# EAGLE schematic MVSch5 (EAGLE 9.6.2)
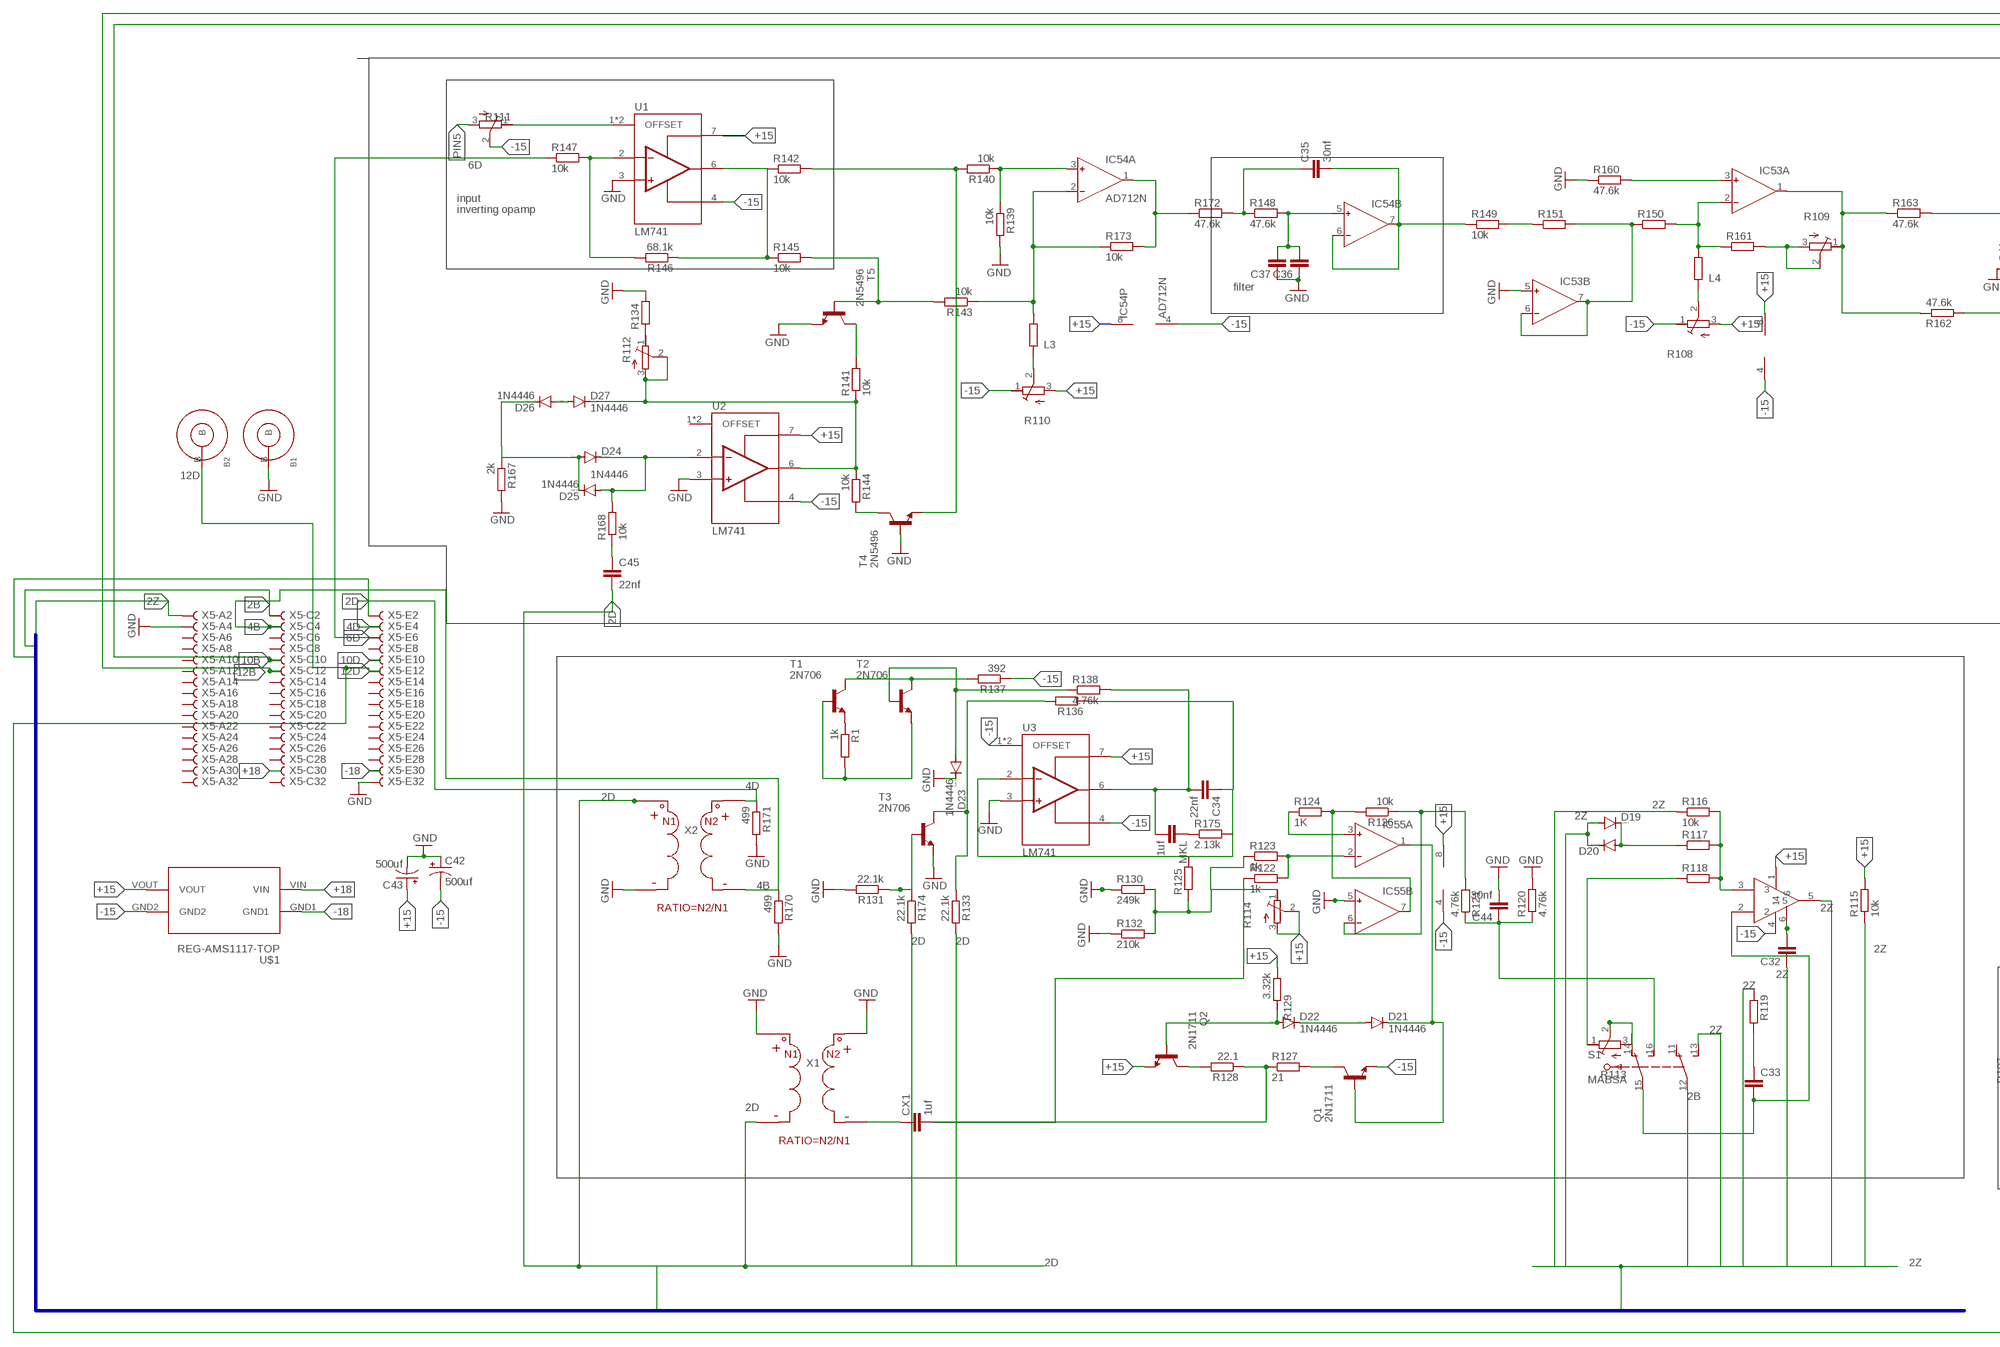
[diagram p0: schematic, sheet 1, part 1 of 2]
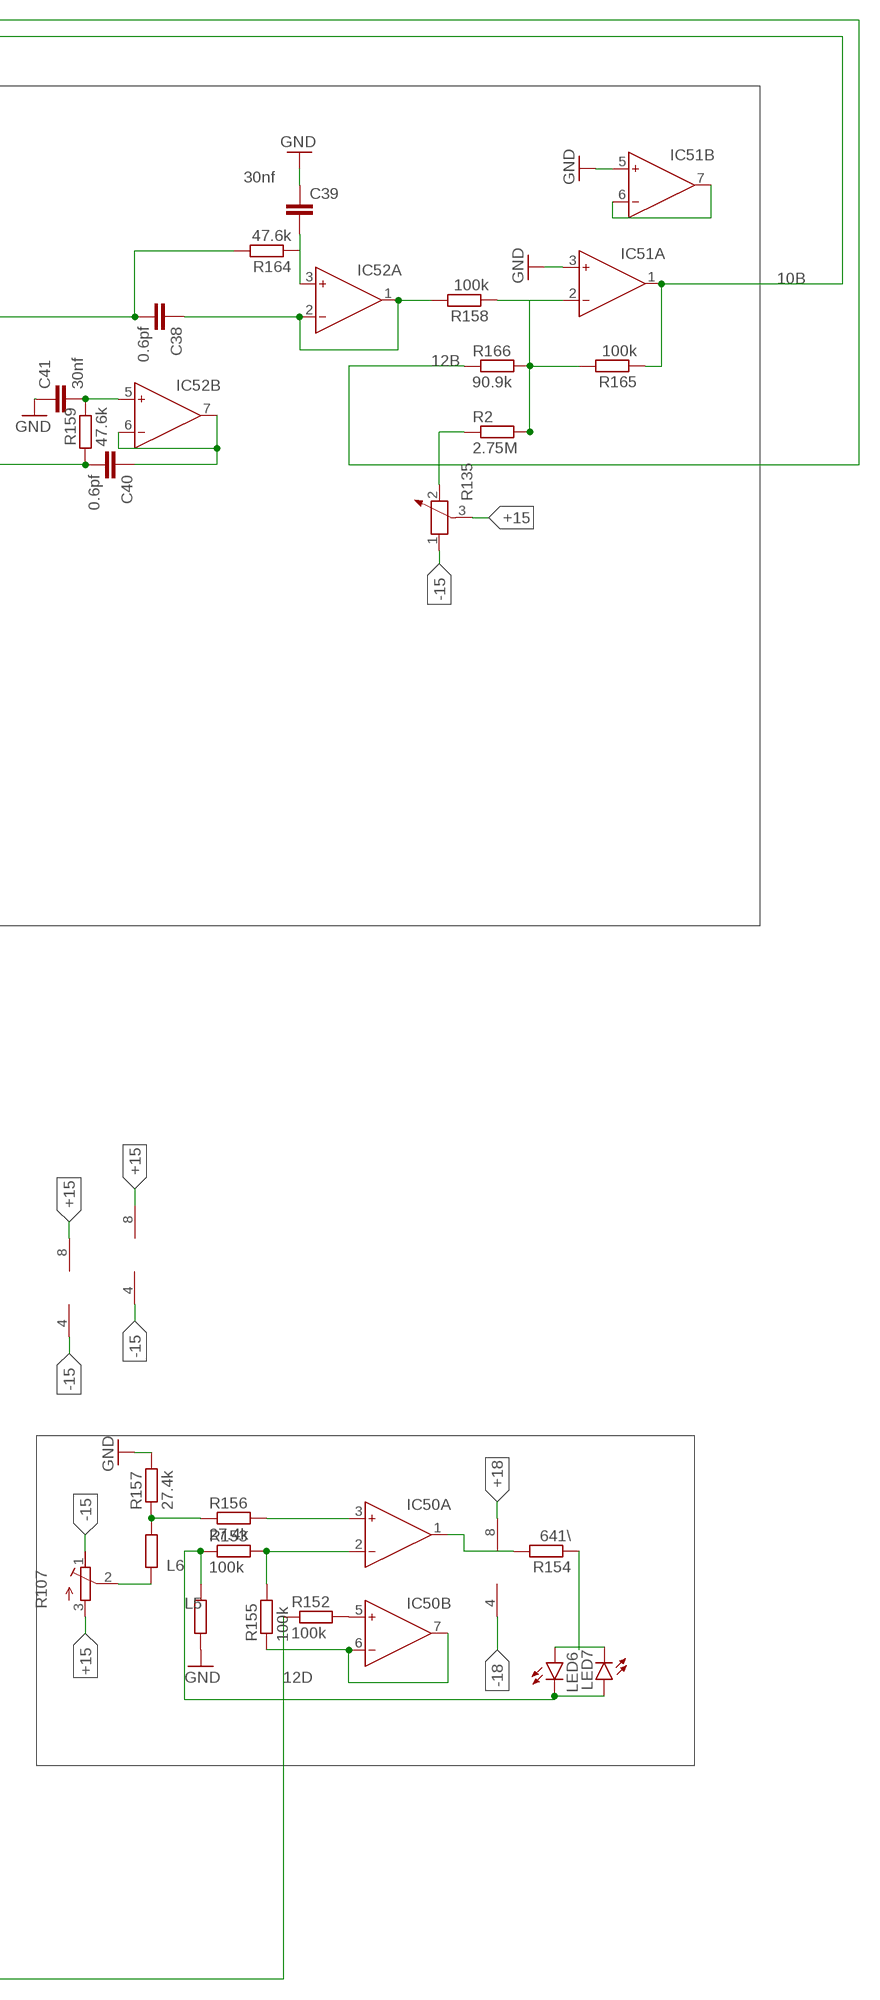
[diagram p1: schematic, sheet 1, part 2 of 2]

## Parts
B1  BANANA_CONNECTOR_DEVICE  [BANANA_CONNECTOR_FOOTPRINT]
B2  BANANA_CONNECTOR_DEVICE  [BANANA_CONNECTOR_FOOTPRINT]
C32  C-EU025-025X050  [C025-025X050]
C33  C-EU075-032X103  [C075-032X103]
C34  22nf  C-EU050-024X044  [C050-024X044]
C35  30nf  C-EU050-024X044  [C050-024X044]
C36  C-EU050-024X044  [C050-024X044]
C37  C-EU050-024X044  [C050-024X044]
C38  0.6pf  C-EU050-024X044  [C050-024X044]
C39  30nf  C-EU050-024X044  [C050-024X044]
C40  0.6pf  C-EU050-024X044  [C050-024X044]
C41  30nf  C-EU050-024X044  [C050-024X044]
C42  500uf  CPOL-USE35-12AXIAL  [E35-12]
C43  500uf  CPOL-USE35-12AXIAL  [E35-12]
C44  30nf  C-EU075-032X103  [C075-032X103]
C45  22nf  C-EU050-024X044  [C050-024X044]
CX1  1uf  CXXC15B8  [XC15B8]
D19  1N4446  [DO35-10]
D20  1N4446  [DO35-10]
D21  1N4446  [DO35-10]
D22  1N4446  [DO35-10]
D23  1N4446  [DO35-10]
D24  1N4446  [DO35-10]
D25  1N4446  [DO35-10]
D26  1N4446  [DO35-10]
D27  1N4446  [DO35-10]
IC50  AD712N  [DIL08]
IC51  AD712N  [DIL08]
IC52  AD712N  [DIL08]
IC53  AD712N  [DIL08]
IC54  AD712N  [DIL08]
IC55  AD712N  [DIL08]
L3  R-EU_0204/7  [0204/7]
L4  R-EU_0204/7  [0204/7]
L5  R-EU_0204/7  [0204/7]
L6  R-EU_0204/7  [0204/7]
LED6  LED5MM  [LED5MM]
LED7  LED5MM  [LED5MM]
MKL  1uf  C-EU075-052X106  [C075-052X106]
OP1  TAA761_DEVICE  [SOIC8_208MIL]
Q1  2N1711  [TO39]
Q2  2N1711  [TO39]
R1  1k  R-EU_0204/7  [0204/7]
R2  2.75M  R-EU_0204/7  [0204/7]
R107  R-TRIMM43P  [RTRIM43P]
R108  R-TRIMM43P  [RTRIM43P]
R109  R-TRIMM43P  [RTRIM43P]
R110  R-TRIMM43P  [RTRIM43P]
R111  R-TRIMM43P  [RTRIM43P]
R112  R-TRIMM43P  [RTRIM43P]
R113  R-TRIMM43P  [RTRIM43P]
R114  R-TRIMM43P  [RTRIM43P]
R115  10k  R-EU_0204/7  [0204/7]
R116  10k  R-EU_0204/7  [0204/7]
R117  R-EU_0204/7  [0204/7]
R118  R-EU_0204/7  [0204/7]
R119  R-EU_0204/7  [0204/7]
R120  4.76k  R-EU_0204/7  [0204/7]
R121  4.76k  R-EU_0204/7  [0204/7]
R122  1k  R-EU_0204/7  [0204/7]
R123  1k  R-EU_0204/7  [0204/7]
R124  1K  R-EU_0204/7  [0204/7]
R125  R-EU_0204/7  [0204/7]
R126  10k  R-EU_0204/7  [0204/7]
R127  21  R-EU_0204/7  [0204/7]
R128  22.1  R-EU_0204/7  [0204/7]
R129  3.32k  R-EU_0204/7  [0204/7]
R130  249k  R-EU_0204/7  [0204/7]
R131  22.1k  R-EU_0204/7  [0204/7]
R132  210k  R-EU_0204/7  [0204/7]
R133  22.1k  R-EU_0204/7  [0204/7]
R134  R-EU_0204/7  [0204/7]
R135  POTENTIOMETER_PT-10  [PT-10]
R136  R-EU_0204/7  [0204/7]
R137  392  R-EU_0204/7  [0204/7]
R138  4.76k  R-EU_0204/7  [0204/7]
R139  10k  R-EU_0204/7  [0204/7]
R140  10k  R-EU_0204/7  [0204/7]
R141  10k  R-EU_0204/7  [0204/7]
R142  10k  R-EU_0204/7  [0204/7]
R143  10k  R-EU_0204/7  [0204/7]
R144  10k  R-EU_0204/7  [0204/7]
R145  10k  R-EU_0204/7  [0204/7]
R146  68.1k  R-EU_0204/7  [0204/7]
R147  10k  R-EU_0204/7  [0204/7]
R148  47.6k  R-EU_0204/7  [0204/7]
R149  10k  R-EU_0204/7  [0204/7]
R150  R-EU_0204/7  [0204/7]
R151  R-EU_0204/7  [0204/7]
R152  100k  R-EU_0204/7  [0204/7]
R153  100k  R-EU_0204/7  [0204/7]
R154  641\  R-EU_0204/7  [0204/7]
R155  100k  R-EU_0204/7  [0204/7]
R156  27.4k  R-EU_0204/7  [0204/7]
R157  27.4k  R-EU_0204/7  [0204/7]
R158  100k  R-EU_0204/7  [0204/7]
R159  47.6k  R-EU_0204/7  [0204/7]
R160  47.6k  R-EU_0204/7  [0204/7]
R161  R-EU_0204/7  [0204/7]
R162  47.6k  R-EU_0204/7  [0204/7]
R163  47.6k  R-EU_0204/7  [0204/7]
R164  47.6k  R-EU_0204/7  [0204/7]
R165  100k  R-EU_0204/7  [0204/7]
R166  90.9k  R-EU_0204/7  [0204/7]
R167  2k  R-EU_0204/7  [0204/7]
R168  10k  R-EU_0204/7  [0204/7]
R170  499  R-EU_0204/7  [0204/7]
R171  499  R-EU_0204/7  [0204/7]
R172  47.6k  R-EU_0204/7  [0204/7]
R173  10k  R-EU_0204/7  [0204/7]
R174  22.1k  R-EU_0204/7  [0204/7]
R175  2.13k  R-EU_0204/7  [0204/7]
S1  MABSA  [MABSA]
T1  2N706  [TO18]
T2  2N706  [TO18]
T3  2N706  [TO18]
T4  2N5496  [TO220]
T5  2N5496  [TO220]
U1  LM741  [DIP794W45P254L1016H508Q8]
U2  LM741  [DIP794W45P254L1016H508Q8]
U3  LM741  [DIP794W45P254L1016H508Q8]
U$1  REG-AMS1117-TOP  [REG-AMS1117_TOP]
X1  TRANSFORMER  (no package)
X2  TRANSFORMER  (no package)
X5  FACE48E  [FACE48E]

## Nets
2B: S1.12 X5.C2
2D: C45.2 R133.2 R174.2 X1.P$2 X2.P$1 X5.E2
2Z: C32.1 D19.A D20.C OP1.5 R115.1 R116.1 R119.1 S1.13 X5.A2
4B: R170.1 X2.P$4 X5.C4
4D: R171.1 X2.P$3 X5.E4
6D: R147.1 X5.E6
10B: IC51.1(A:OUT) R165.1 X5.C10
12B: R166.1 X5.C12
12D: B2.B R152.1 X5.E12
+15: C43.+ IC51.8(P:V+) IC52.8(P:V+) IC53.8(P:V+) IC54.8(P:V+) IC55.8(P:V+) OP1.1 Q2.1(E) R107.3(A) R108.3(A) R110.3(A) R114.2(S) R114.3(A) R115.2 R129.1 R135.3 U1.7(V+) U2.7(V+) U3.7(V+) U$1.VOUT
+18: IC50.8(P:V+) U$1.VIN X5.C30
-15: C42.- IC51.4(P:V-) IC52.4(P:V-) IC53.4(P:V-) IC54.4(P:V-) IC55.4(P:V-) OP1.4 Q1.1(E) R107.1(E) R108.1(E) R110.1(E) R111.2(S) R135.1 R137.1 U1.4(V-) U2.4(V-) U3.1(OFFSET) U3.4(V-) U3.5(OFFSET) U$1.GND2
-18: IC50.4(P:V-) U$1.GND1 X5.E30
GND: B1.B C36.1 C37.1 C39.1 C41.1 C42.+ C43.- C44.2 D23.C IC51.3(A:IN+) IC51.5(B:IN+) IC53.5(B:IN+) IC55.5(B:IN+) L5.2 R120.2 R130.1 R131.2 R132.1 R134.2 R139.2 R157.2 R160.1 R167.2 R170.2 R171.2 T3.1(E) T4.1(B) T5.3(E) U1.3(NON-INV_INPUT) U2.3(NON-INV_INPUT) U3.3(NON-INV_INPUT) X1.P$1 X1.P$3 X2.P$2 X5.A4 X5.E32
L1: L5.1 LED6.K(C) LED7.A R153.1
L2: LED6.A LED7.K(C) R154.1
N$1: C36.2 C37.2 IC54.5(B:IN+) R148.2
N$2: D27.C R112.2(S) R112.3(A) R141.1 R144.1 U2.6(OUTPUT)
N$3: IC54.2(A:IN-) L3.2 R143.1 R173.1
N$4: D24.C D25.A R168.2 U2.2(INV_INPUT)
N$5: R146.2 R147.2 U1.2(INV_INPUT)
N$6: IC53.1(A:OUT) R109.1(E) R162.1 R163.1
N$7: R142.1 R145.1 R146.1 U1.6(OUTPUT)
N$8: IC53.2(A:IN-) L4.2 R150.2 R161.1
N$9: IC53.6(B:IN-) IC53.7(B:OUT) R150.1 R151.2
N$10: D22.A Q2.2(B) R129.2
N$11: D21.C IC55.1(A:OUT) Q1.2(B)
N$12: Q1.3(C) R127.2
N$13: R137.2 T1.3(C) T2.3(C)
N$14: Q2.3(C) R128.2
N$15: R1.2 T1.2(B) T2.1(E)
N$16: R1.1 T1.1(E)
N$17: R133.1 R136.2 T3.3(C)
N$18: R2.1 R135.2
N$158: L3.1 R110.2(S)
N$271: C38.1 IC52.1(A:OUT) IC52.2(A:IN-) R158.2
N$272: IC50.1(A:OUT) R154.2
N$273: IC50.2(A:IN-) R153.2 R155.2
N$274: IC50.3(A:IN+) R156.2
N$275: L6.2 R156.1 R157.1
N$276: C41.2 IC52.5(B:IN+) R159.1
N$277: IC50.5(B:IN+) R152.2
N$279: C39.2 IC52.3(A:IN+) R164.1
N$283: IC51.2(A:IN-) R2.2 R158.1 R165.2 R166.2
N$284: C35.1 R148.1 R172.2
N$285: IC54.1(A:OUT) R172.1 R173.2
N$287: C32.2 OP1.6
N$288: D19.C D20.A R117.1
N$289: C33.1 R119.2
N$290: OP1.3 R116.2 R117.2 R118.2
N$291: R112.1(E) R134.1
N$292: L6.1 R107.2(S)
N$293: L4.1 R108.2(S)
N$294: R109.2(S) R109.3(A) R161.2
N$296: C33.2 OP1.2 S1.15
N$297: R111.1(E) U1.1(OFFSET) U1.5(OFFSET)
N$299: C44.1 R120.1 R121.1 S1.16
N$300: R113.2(S) R113.3(A) S1.14
N$301: R113.1(E) R118.1
N$302: CX1.2 R122.1 R127.1 R128.1
N$303: C34.1 R136.1 R175.2
N$304: R114.1(E) R123.1 R125.1 R130.2 R132.2
N$306: D21.A D22.C
N$310: C38.2 R163.2 R164.2
N$311: C40.2 R159.2 R162.2
N$312: IC53.3(A:IN+) R160.2
N$314: C35.2 IC54.6(B:IN-) IC54.7(B:OUT) R149.1
N$315: IC54.3(A:IN+) R139.1 R140.1
N$316: IC55.2(A:IN-) R122.2 R123.2
N$317: IC55.3(A:IN+) R124.1
N$318: IC55.6(B:IN-) R121.2 R126.1
N$319: IC55.7(B:OUT) R124.2 R126.2
N$320: R125.2 U3.2(INV_INPUT)
N$321: CX1.1 X1.P$4
N$322: C45.1 R168.1
N$324: R131.1 R174.1 T3.2(B)
N$325: D23.A R138.1 T2.2(B)
N$329: R140.2 R142.2 T4.3(E)
N$330: R144.2 T4.2(C)
N$331: R143.2 R145.2 T5.1(B)
N$332: R141.2 T5.2(C)
N$335: MKL.1 R175.1
N$336: C34.2 MKL.2 R138.2 U3.6(OUTPUT)
N$338: D26.A D27.A
N$339: D24.A D25.C D26.C R167.1
N$341: IC50.6(B:IN-) IC50.7(B:OUT) R155.1
N$342: IC51.6(B:IN-) IC51.7(B:OUT)
N$343: C40.1 IC52.6(B:IN-) IC52.7(B:OUT)
N$359: R149.2 R151.1
PIN5: R111.3(A)
Unconnected: S1.11 U2.1(OFFSET) U2.5(OFFSET) X5.A6 X5.A8 X5.A10 X5.A12 X5.A14 X5.A16 X5.A18 X5.A20 X5.A22 X5.A24 X5.A26 X5.A28 X5.A30 X5.A32 X5.C6 X5.C8 X5.C14 X5.C16 X5.C18 X5.C20 X5.C22 X5.C24 X5.C26 X5.C28 X5.C32 X5.E8 X5.E10 X5.E14 X5.E16 X5.E18 X5.E20 X5.E22 X5.E24 X5.E26 X5.E28

## Buses
-15
B$3
CONNECTOR(2):2B,2D,2Z

## Notes on the sheet
- input
- inverting opamp
- filter

## Library data of the parts
B1 B2 = BananaConnector:BANANA_CONNECTOR_DEVICE
C32-C41 C44 C45 MKL = rcl:C-EU: CAPACITOR, European symbol
C42 C43 = rcl:CPOL-US: POLARIZED CAPACITOR, American symbol; SPICEPREFIX: C
CX1 = rcl:CX: X CAPACITOR for power line; SPICEPREFIX: C
D19-D27 = diode:1N4446: DIODE high speed (Philips)
IC50-IC55 = analog-devices:AD712: Dual Precision, Low Cost, High Speed BiFET Op Amp Source: http://www.analog.com/static/imported-files/data_sheets/AD712.pdf; MF: ALTERA CORPORATION; MPN: AD712JNZ; OC_FARNELL: 9604898; OC_NEWARK: 59K4554
L3-L6 R1 R2 R115-R134 R136-R168 R170-R175 = rcl:R-EU_: RESISTOR, European symbol; SPICEPREFIX: R
LED6 LED7 = led:LED: LED OSRAM: - CHIPLED LG R971, LG N971, LY N971, LG Q971, LY Q971, LO R971, LY R971 LH N974, LH R974 LS Q976, LO Q976, LY Q976 LO Q996 - Hyper CHIPLED LW Q18S LB Q993, LB Q99A, LB R99A - SideLED LS A670, LO A670, LY A670, LG A670, LP A670 LB A673, LV A673, LT A673, LW A673 LH A674 LY A675 LS A676, LA A676, LO A676, LY A676, LW A676 LS A679, LY A679, LG A679 - Hyper Micro SIDELED® LS Y876, LA Y876, LO Y876, LY Y876 LT Y87S - SmartLED LW L88C, LW L88S LB L89C, LB L89S, LG L890 LS L89K, LO L89K, LY L89K LS L896, LA L896, LO L896, LY L896 - TOPLED LS T670, LO T670, LY T670, LG T670, LP T670 LSG T670, LSP T670, LSY T670, LOP T670, LYG T670 LG T671, LOG T671, LSG T671 LB T673, LV T673, LT T673, LW T673 LH T674 LS T676, LA T676, LO T676, LY T676, LB T676, LH T676, LSB T676, LW T676 LB T67C, LV T67C, LT T67C, LS T67K, LO T67K, LY T67K, LW E67C LS E67B, LA E67B, LO E67B, LY E67B, LB E67C, LV E67C, LT E67C LW T67C LS T679, LY T679, LG T679 LS T770, LO T770, LY T770, LG T770, LP T770 LB T773, LV T773, LT T773, LW T773 LH T774 LS E675, LA E675, LY E675, LS T675 LS T776, LA T776, LO T776, LY T776, LB T776 LHGB T686 LT T68C, LB T68C - Hyper Mini TOPLED® LB M676 - Mini TOPLED Santana® LG M470 LS M47K, LO M47K, LY M47K Source: http://www.osram.convergy.de LUXEON: - LUMILED® LXK2-PW12-R00, LXK2-PW12-S00, LXK2-PW14-U00, LXK2-PW14-V00 LXK2-PM12-R00, LXK2-PM12-S00, LXK2-PM14-U00 LXK2-PE12-Q00, LXK2-PE12-R00, LXK2-PE12-S00, LXK2-PE14-T00, LXK2-PE14-U00 LXK2-PB12-K00, LXK2-PB12-L00, LXK2-PB12-M00, LXK2-PB14-N00, LXK2-PB14-P00, LXK2-PB14-Q00 LXK2-PR12-L00, LXK2-PR12-M00, LXK2-PR14-Q00, LXK2-PR14-R00 LXK2-PD12-Q00, LXK2-PD12-R00, LXK2-PD12-S00 LXK2-PH12-R00, LXK2-PH12-S00 LXK2-PL12-P00, LXK2-PL12-Q00, LXK2-PL12-R00 Source: www.luxeon.com KINGBRIGHT: KA-3528ASYC Source: www.kingbright.com
OP1 = TAA761:TAA761_DEVICE
Q1 Q2 = transistor-npn:2N1711: NPN Transistor
R107-R114 = rcl:R-TRIMM: Trimm resistor; SPICEMODEL: X; SPICEPREFIXL: POT
R135 = rcl:POTENTIOMETER_: Potentiometer; SPICEMODEL: POT; SPICEPREFIX: X
S1 = con-hirschmann:MABSA: Dual SWITCH; OC_FARNELL: unknown; OC_NEWARK: unknown
T1-T3 = transistor:2N706: NPN TRANSISTOR
T4 T5 = transistor:2N5496: NPN TRANSISTOR
U1-U3 = LM741:LM741; AVAILABILITY: Unavailable; DESCRIPTION: General Purpose Amplifier 1 Circuit TO-99-8; MF: Texas Instruments; MP: LM741; PACKAGE: DIP-8 Texas Instruments; PRICE: None
U$1 = MIA_LIBRARY-2-2-2:REG-AMS1117-TOP: Linear Regulator based on AMS1117 chip
X1 X2 = ngspice-simulation:TRANSFORMER: Coupled inductors The RATIO is defined in the schematic by using the text command and adding a line that says: .PARAM RATIO=x Where x is the turns ratio of the transformer
X5 = con-vg:FACE48E: CONNECTOR female, 48 pins, single, type C, rows ABC, grid 5.08 mm

## Module TAA
Ports: 1(io) 2(io) 3(io) 4(io) 5(io) 6(io)

### Library data of the parts

## Module REG
Ports: POS_IN(io) NEG_IN(io) +15(io) -15(io)

### Library data of the parts

## Module UNKNOWN
Ports: 1(io) 2(io) 3(io) 4(io) 5(io) 6(io) 7(io) 8(io)

### Library data of the parts

## Module UNKNOWN3
Ports: 1(io) 2(io) 3(io) 4(io) 5(io) 6(io) 7(io) 8(io)

### Library data of the parts